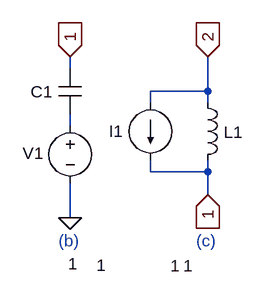
[diagram p0: schematic Cap_Ind_init_cond_model_v0.asc]
Cap_Ind_init_cond_model_v0.asc, the LTspice schematic file:
Version 4
SHEET 1 880 680
WIRE 176 128 176 112
WIRE 368 160 368 112
WIRE 368 160 288 160
WIRE 288 176 288 160
WIRE 368 176 368 160
WIRE 176 208 176 192
WIRE 288 272 288 256
WIRE 368 272 368 256
WIRE 368 272 288 272
WIRE 368 304 368 272
WIRE 176 336 176 288
FLAG 176 112 1
IOPIN 176 112 In
FLAG 368 112 2
IOPIN 368 112 In
FLAG 368 304 1
IOPIN 368 304 In
FLAG 176 336 0
SYMBOL cap 160 128 R0
WINDOW 0 -39 33 Left 2
WINDOW 3 13 272 Left 2
SYMATTR InstName C1
SYMATTR Value 1
SYMBOL voltage 176 192 R0
WINDOW 0 -66 54 Left 2
WINDOW 3 37 210 Left 2
SYMATTR InstName V1
SYMATTR Value 1
SYMBOL ind 352 160 R0
WINDOW 0 38 57 Left 2
WINDOW 3 -18 243 Left 2
SYMATTR InstName L1
SYMATTR Value 1
SYMBOL current 288 176 R0
WINDOW 0 -58 40 Left 2
WINDOW 3 28 227 Left 2
SYMATTR InstName I1
SYMATTR Value 1
TEXT 160 368 Left 2 ;(b)
TEXT 352 368 Left 2 ;(c)

The netlist it stands for:
* Cap_Ind_init_cond_model_v0.asc
C1 1 N001 1
V1 N001 0 1
L1 2 1 1
I1 2 1 1
* (b)
* (c)
.backanno
.end